# EAGLE schematic RFM69OP (EAGLE 6.6.0)
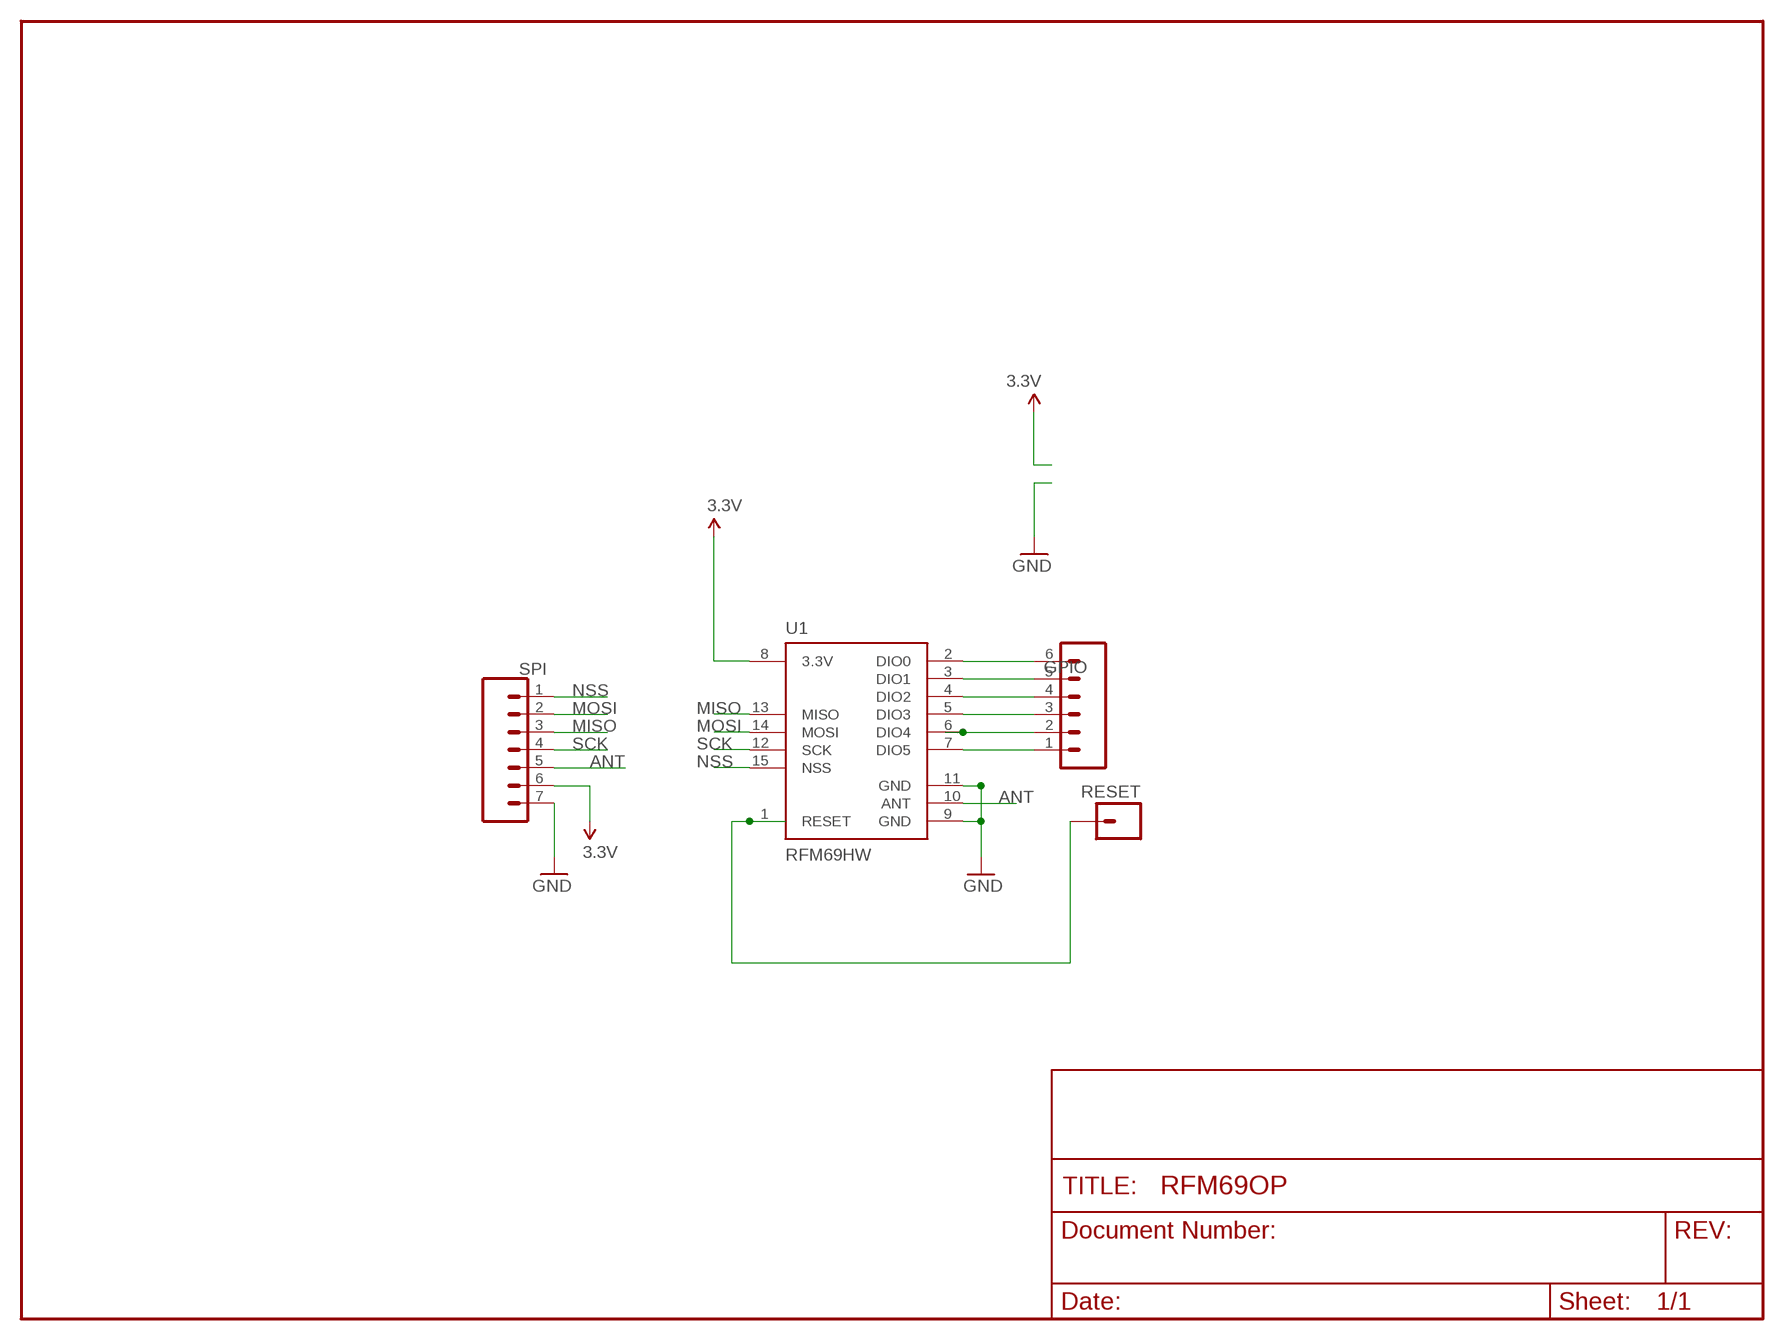
[diagram p0: schematic, sheet 1]

## Parts
JP2  RESET  M01PTH  [1X01]
JP3  GPIO  M06LOCK  [1X06_LOCK]
JP4  SPI  M07LOCK  [1X07_LOCK]
U1  RFM69HW  [RFM69W-XXXS2]

## Nets
3.3V: JP4.6 U1.8(3.3V)
ANT: JP4.5 U1.10(ANT)
DIO0: JP3.6 U1.2(DIO0)
DIO1: JP3.5 U1.3(DIO1)
DIO2: JP3.4 U1.4(DIO2)
DIO3: JP3.3 U1.5(DIO3)
DIO4: JP3.2 U1.6(DIO4)
DIO5: JP3.1 U1.7(DIO5)
GND: JP4.7 U1.9(GND) U1.11(GND)
MISO: JP4.3 U1.13(MISO)
MOSI: JP4.2 U1.14(MOSI)
NSS: JP4.1 U1.15(NSS)
RESET: JP2.1 U1.1(RESET)
SCK: JP4.4 U1.12(SCK)

## Library data of the parts
JP2 = SparkFun-Connectors:M01: Header 1 Standard 1-pin 0.1" header. Use with straight break away headers (SKU : PRT-00116), right angle break away headers (PRT-00553), swiss pins (PRT-00743), machine pins (PRT-00117), and female headers (PRT-00115).
JP3 = SparkFun-Connectors:M06: Header 6 Standard 6-pin 0.1" header. Use with straight break away headers (SKU : PRT-00116), right angle break away headers (PRT-00553), swiss pins (PRT-00743), machine pins (PRT-00117), and female headers (PRT-00115). Molex polarized connector foot print use with SKU : PRT-08094 with associated crimp pins and housings. NOTES ON THE VARIANTS LOCK and LOCK_LONGPADS... This footprint was designed to help hold the alignment of a through-hole component (i.e. 6-pin header) while soldering it into place. You may notice that each hole has been shifted either up or down by 0.005 of an inch from it's more standard position (which is a perfectly straight line). This slight alteration caused the pins (the squares in the middle) to touch the edges of the holes. Because they are alternating, it causes a "brace" to hold the component in place. 0.005 has proven to be the perfect amount of "off-center" position when using our standard breakaway headers. Although looks a little odd when you look at the bare footprint, once you have a header in there, the alteration is very hard to notice. Also,if you push a header all the way into place, it is covered up entirely on the bottom side. This idea of altering the position of holes to aid alignment will be further integrated into the Sparkfun Library for other footprints. It can help hold any component with 3 or more connection pins.
JP4 = SparkFun-Connectors:M07: Header 7 Standard 7-pin 0.1" header. Use with straight break away headers (SKU : PRT-00116), right angle break away headers (PRT-00553), swiss pins (PRT-00743), machine pins (PRT-00117), and female headers (PRT-00115). NOTES ON THE VARIANTS LOCK and LOCK_LONGPADS... This footprint was designed to help hold the alignment of a through-hole component (i.e. 7-pin header) while soldering it into place. You may notice that each hole has been shifted either up or down by 0.005 of an inch from it's more standard position (which is usually a perfectly straight line). This slight alteration caused the pins (the squares in the middle) to touch the edges of the holes. Because they are alternating, it causes a "brace" to hold the header in place. 0.005 has proven to be the perfect amount of "off-center" position when using our standard breakaway headers. Although looks a little odd when you look at the bare footprint, once you have a header in there, the alteration is very hard to notice. Also, if you push a header all the way into place, it is covered up entirely on the bottom side. This idea of altering the position of holes to aid alignment will be further integrated into the Sparkfun Library for other footprints. It can help hold any component with 3 or more connection pins.
U1 = SparkFun-RF:RFM69H